# EAGLE design crypto_programmer (EAGLE 8.3.0)

## Sheet 1 of 2
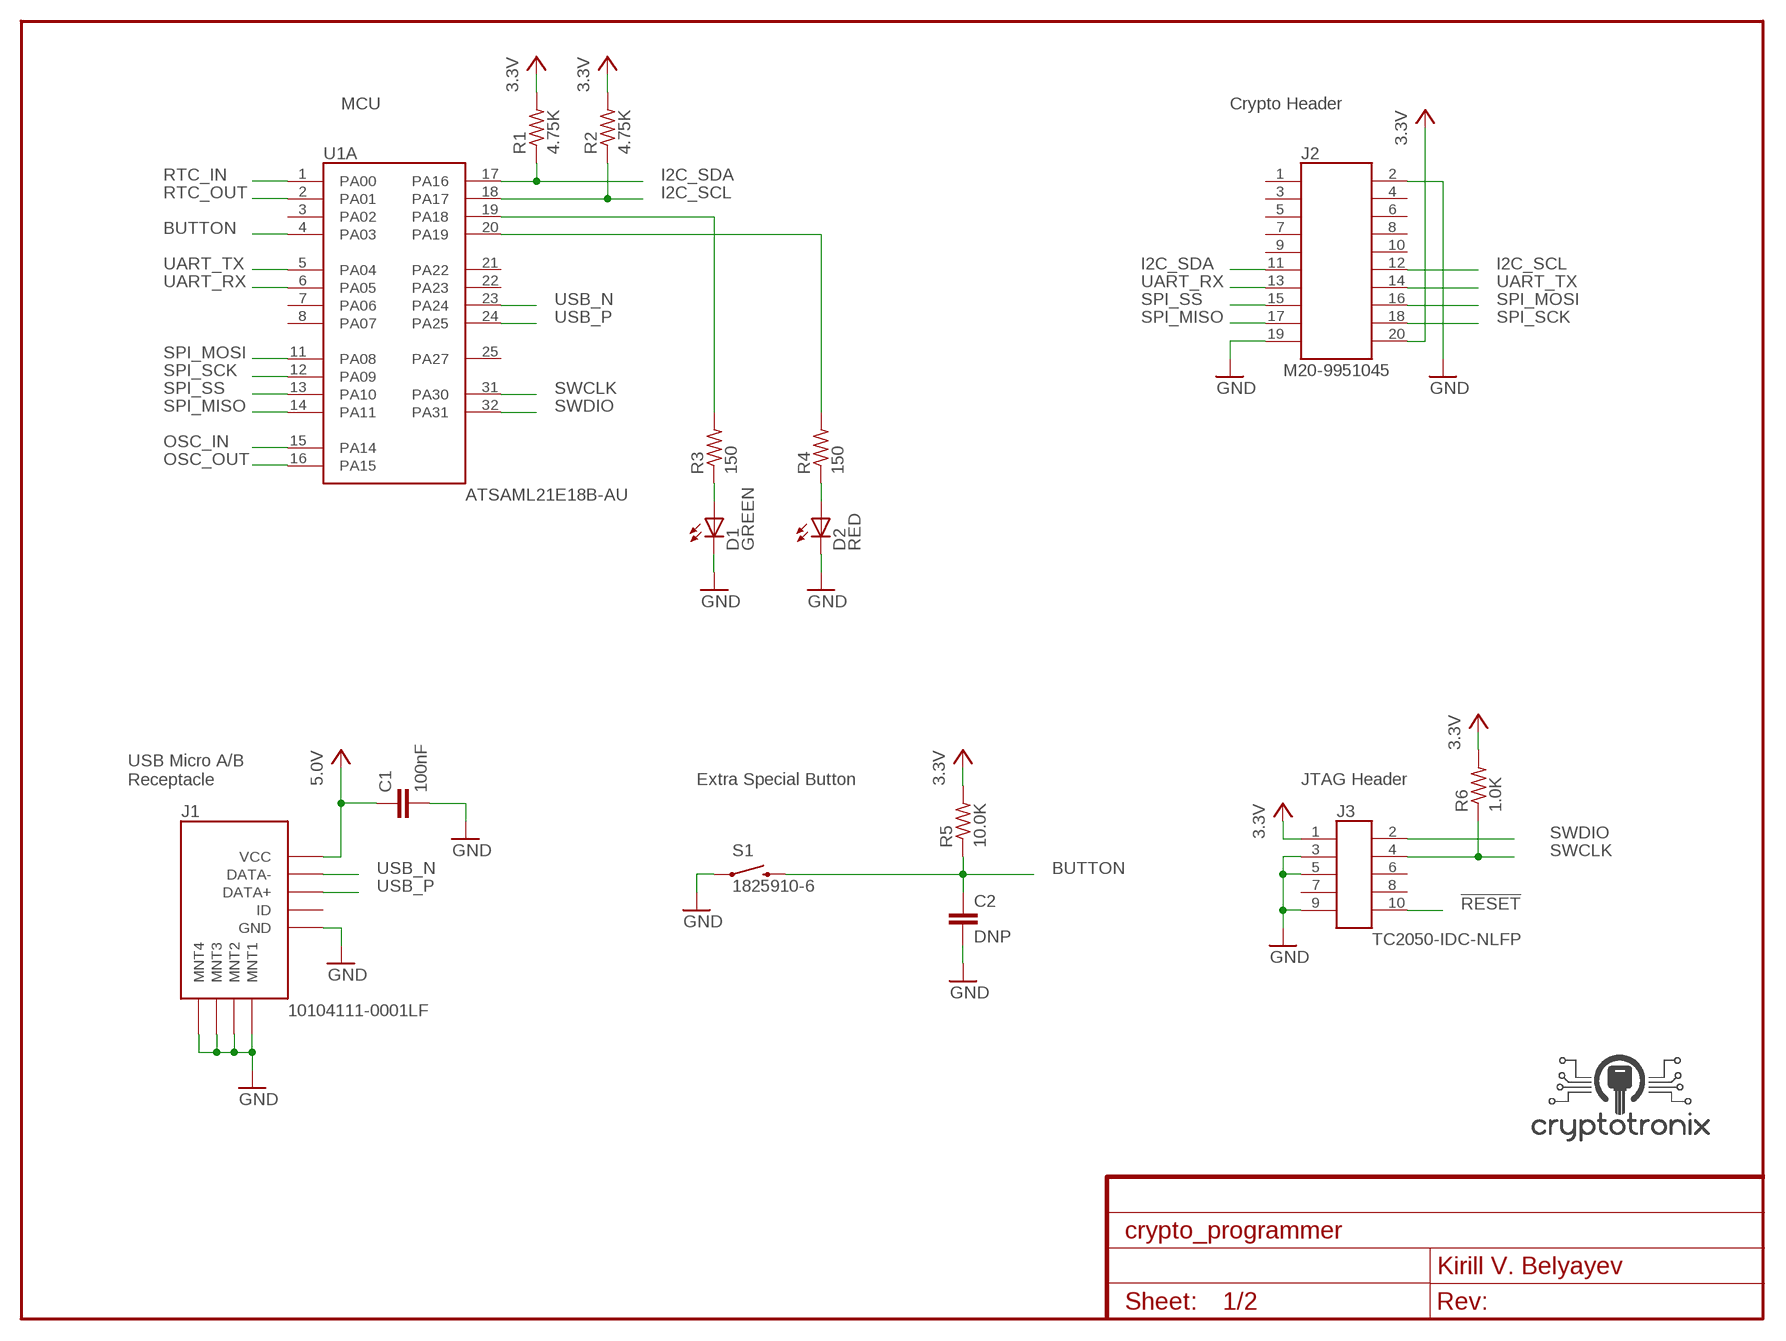
[diagram p0: schematic, sheet 1]
FRAME1 (FRAME-LETTER): CNAME: MCU Connections; CREVISION: A; DESIGNER: Kirill V. Belyayev

### Parts
C1  100nF  C-EUC0603  [C0603]
C2  DNP  C-EUC0603  [C0603]
D1  GREEN  LTST-C190GKT  [0603]
D2  RED  LTST-C190EKT  [0603]
J1  10104111-0001LF  [10104111-0001LF]
J2  M20-9951045  [M20-9951045]
J3  TC2050-IDC-NLFP  [TC2050-IDC-NLFP]
LOGO1  CRYPTOTRONIX_LOGO  [CRYPTOTRONIX_LOGO]
R1  4.75K  R-US_R0603  [R0603]
R2  4.75K  R-US_R0603  [R0603]
R3  150  R-US_R0603  [R0603]
R4  150  R-US_R0603  [R0603]
R5  10.0K  R-US_R0603  [R0603]
R6  1.0K  R-US_R0603  [R0603]
S1  1825910-6  SWITCH-TACT-TH  [SWITCH-TACT-TH]
U1  ATSAML21E18B-AU  [ATSAML21E18-AU]

### Nets
0V: C1.2 C2.2 D1.C D2.C J1.P$5(GND) J1.P$6(MNT1) J1.P$7(MNT2) J1.P$8(MNT3) J1.P$9(MNT4) J2.2 J2.19 J3.3 J3.5 J3.9 S1.1 ; supply symbol labelled GND ; also sheet 2
3.3V: J2.20 J3.1 R1.2 R2.2 R5.2 R6.2 ; also sheet 2
5.0V: C1.1 J1.P$1(VCC) ; also sheet 2
!RESET: J3.10 ; also sheet 2
BUTTON: C2.1 R5.1 S1.3 U1.4(A:PA03)
I2C_SCL: J2.12 R2.1 U1.18(A:PA17) ; also sheet 2
I2C_SDA: J2.11 R1.1 U1.17(A:PA16) ; also sheet 2
N$1: R4.2 U1.20(A:PA19)
N$2: D2.A R4.1
N$11: D1.A R3.1
N$13: R3.2 U1.19(A:PA18)
OSC_IN: U1.15(A:PA14) ; also sheet 2
OSC_OUT: U1.16(A:PA15) ; also sheet 2
RTC_IN: U1.1(A:PA00) ; also sheet 2
RTC_OUT: U1.2(A:PA01) ; also sheet 2
SPI_MISO: J2.17 U1.14(A:PA11)
SPI_MOSI: J2.16 U1.11(A:PA08)
SPI_SCK: J2.18 U1.12(A:PA09)
SPI_SS: J2.15 U1.13(A:PA10)
SWCLK: J3.4 R6.1 U1.31(A:PA30)
SWDIO: J3.2 U1.32(A:PA31)
UART_RX: J2.13 U1.6(A:PA05) ; also sheet 2
UART_TX: J2.14 U1.5(A:PA04) ; also sheet 2
USB_N: J1.P$2(DATA-) U1.23(A:PA24)
USB_P: J1.P$3(DATA+) U1.24(A:PA25)
Unconnected: J1.P$4(ID) J2.1 J2.3 J2.4 J2.5 J2.6 J2.7 J2.8 J2.9 J2.10 J3.6 J3.7 J3.8 U1.3(A:PA02) U1.7(A:PA06) U1.8(A:PA07) U1.21(A:PA22) U1.22(A:PA23) U1.25(A:PA27)

### Notes on the sheet
- MCU | Crypto Header
- USB Micro A/B
  Receptacle
- Extra Special Button | JTAG Header

## Sheet 2 of 2
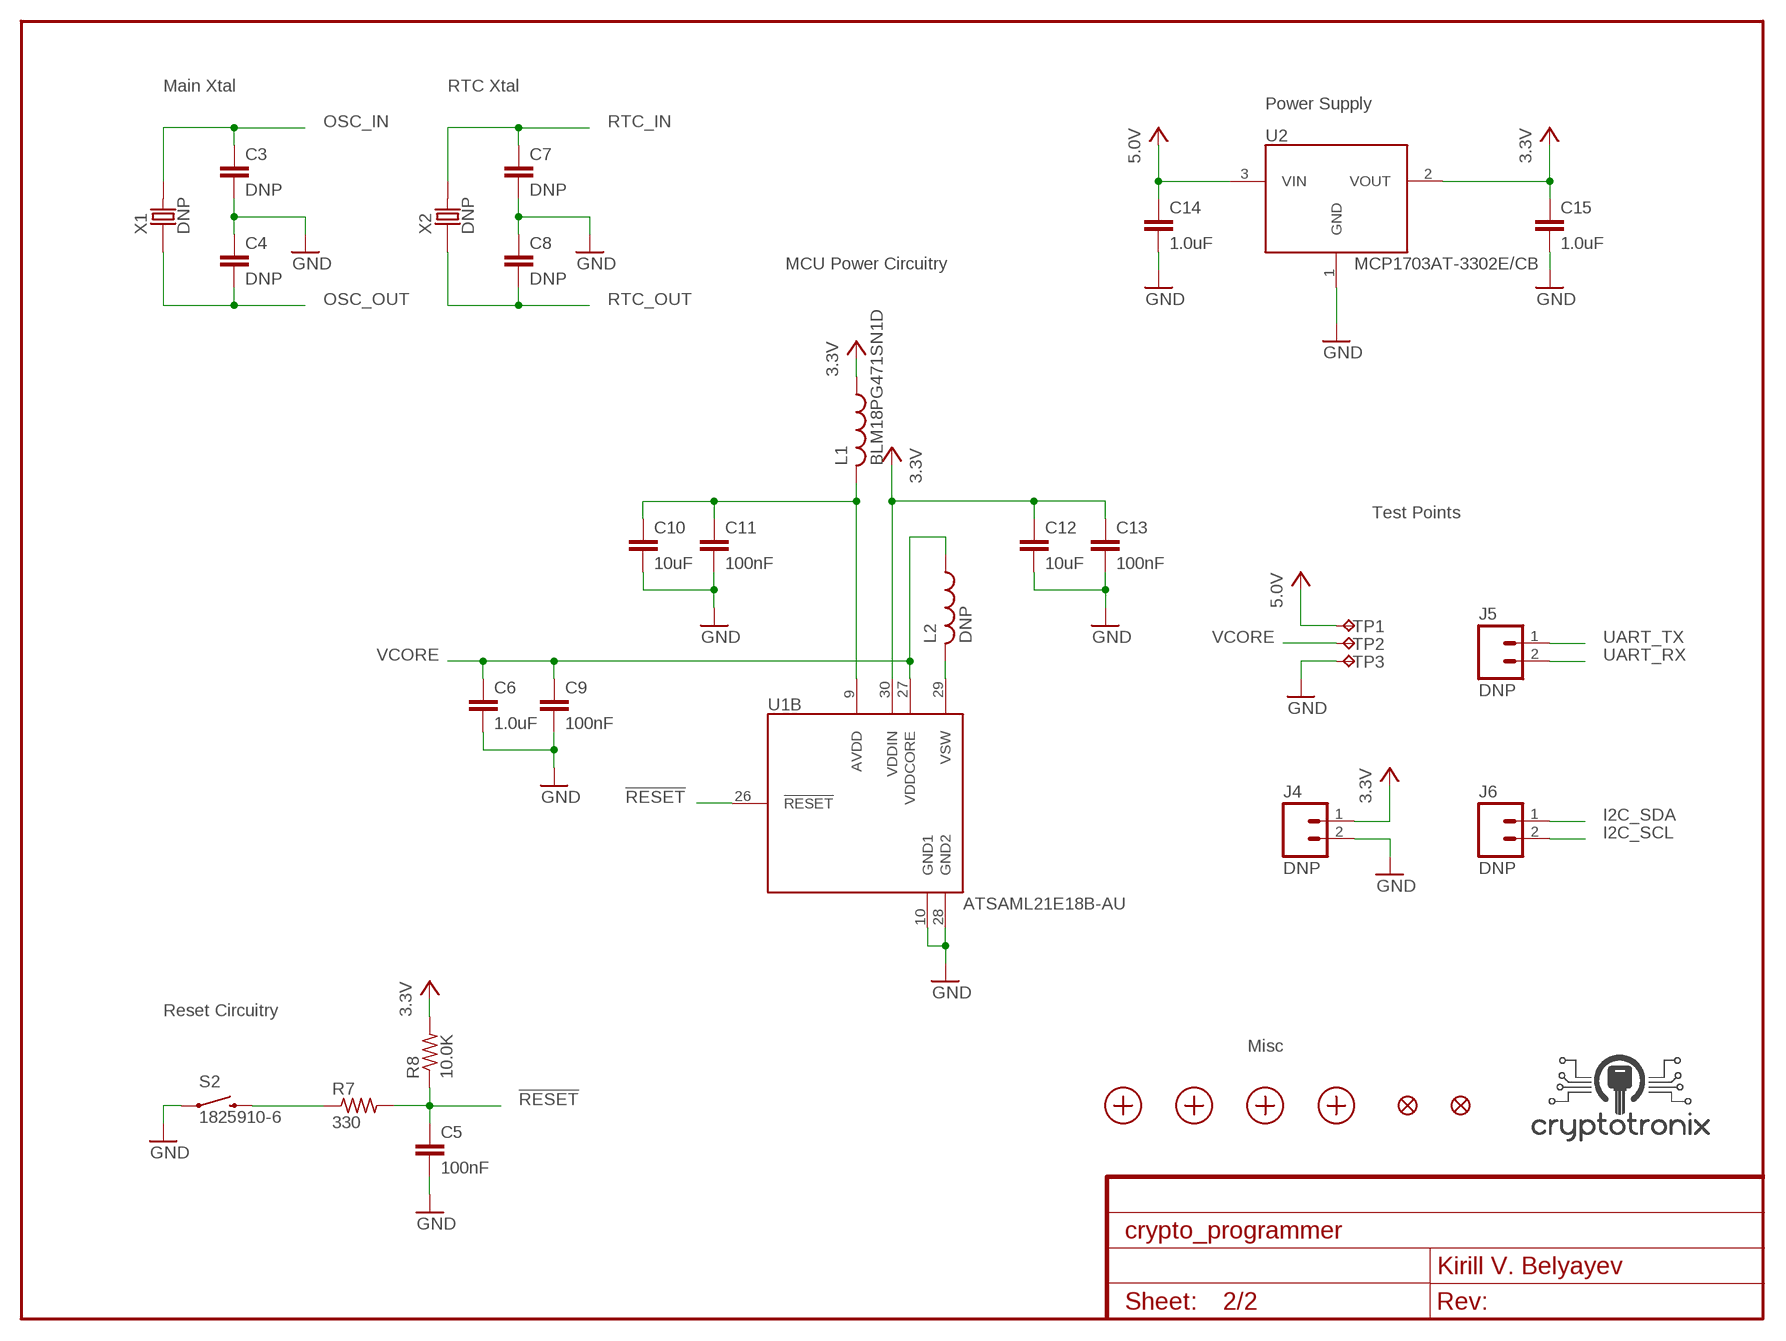
[diagram p1: schematic, sheet 2]
FRAME2 (FRAME-LETTER): CNAME: Power; CREVISION: A; DESIGNER: Kirill V. Belyayev

### Parts
C3  DNP  C-EUC0603  [C0603]
C4  DNP  C-EUC0603  [C0603]
C5  100nF  C-EUC0603  [C0603]
C6  1.0uF  C-EUC0603  [C0603]
C7  DNP  C-EUC0603  [C0603]
C8  DNP  C-EUC0603  [C0603]
C9  100nF  C-EUC0603  [C0603]
C10  10uF  C-EUC0805  [C0805]
C11  100nF  C-EUC0603  [C0603]
C12  10uF  C-EUC0805  [C0805]
C13  100nF  C-EUC0603  [C0603]
C14  1.0uF  C-EUC0603  [C0603]
C15  1.0uF  C-EUC0603  [C0603]
FD1  FIDUCIALUFIDUCIAL  [MICRO-FIDUCIAL]
FD2  FIDUCIALUFIDUCIAL  [MICRO-FIDUCIAL]
J4  DNP  M20-9990246  [M20-9990246]
J5  DNP  M20-9990246  [M20-9990246]
J6  DNP  M20-9990246  [M20-9990246]
L1  BLM18PG471SN1D  L0603  [L0603]
L2  DNP  L0603  [L0603]
LOGO2  CRYPTOTRONIX_LOGO  [CRYPTOTRONIX_LOGO]
MNT1  MOUNT-HOLE-NO-PLATE4-40  [MOUNT-HOLE-NO-PLATE-4-40]
MNT2  MOUNT-HOLE-NO-PLATE4-40  [MOUNT-HOLE-NO-PLATE-4-40]
MNT3  MOUNT-HOLE-NO-PLATE4-40  [MOUNT-HOLE-NO-PLATE-4-40]
MNT4  MOUNT-HOLE-NO-PLATE4-40  [MOUNT-HOLE-NO-PLATE-4-40]
R7  330  R-US_R0603  [R0603]
R8  10.0K  R-US_R0603  [R0603]
S2  1825910-6  SWITCH-TACT-TH  [SWITCH-TACT-TH]
TP1  TEST-POINT40MIL  [TEST-POINT-40MILL]
TP2  TEST-POINT40MIL  [TEST-POINT-40MILL]
TP3  TEST-POINT40MIL  [TEST-POINT-40MILL]
U2  MCP1703AT-3302E/CB  [MCP1703AT-3302E/CB]
X1  DNP  ABL-8.000MHZ-B2  [ABL-8.000MHZ-B2]
X2  DNP  ABS07AIG-32.768KHZ-9-T  [ABS07AIG-32.768KHZ-9-T]

### Nets
0V: C3.2 C4.1 C5.2 C6.2 C7.2 C8.1 C9.2 C10.2 C11.2 C12.2 C13.2 C14.2 C15.2 J4.2 S2.1 TP3.1(PP) U1.10(B:GND1) U1.28(B:GND2) U2.1(GND) ; supply symbol labelled GND ; also sheet 1
3.3V: C12.1 C13.1 C15.1 J4.1 L1.1 R8.2 U1.30(B:VDDIN) U2.2(VOUT) ; also sheet 1
5.0V: C14.1 TP1.1(PP) U2.3(VIN) ; also sheet 1
!RESET: C5.1 R7.2 R8.1 U1.26(B:!RESET) ; also sheet 1
I2C_SCL: J6.2 ; also sheet 1
I2C_SDA: J6.1 ; also sheet 1
N$3: L2.2 U1.29(B:VSW)
N$4: C10.1 C11.1 L1.2 U1.9(B:AVDD)
N$9: R7.1 S2.3
OSC_IN: C3.1 X1.2 ; also sheet 1
OSC_OUT: C4.2 X1.1 ; also sheet 1
RTC_IN: C7.1 X2.2 ; also sheet 1
RTC_OUT: C8.2 X2.1 ; also sheet 1
UART_RX: J5.2 ; also sheet 1
UART_TX: J5.1 ; also sheet 1
VCORE: C6.1 C9.1 L2.1 TP2.1(PP) U1.27(B:VDDCORE)

### Notes on the sheet
- Main Xtal | RTC Xtal
- Power Supply
- MCU Power Circuitry
- Test Points
- Reset Circuitry
- Misc

## Library data of the parts
C1-C15 = rcl:C-EU: CAPACITOR, European symbol
D1 D2 = KVB-diodes:LTST-C190: LED Indication Discrete 2.0V 10mA Test Current 0603 (1608 Metric); MAN-PART_NUM: LTST-C190; MANUFACTURER: Lite-On Inc.
FD1 FD2 = KVB-misc:FIDUCIAL: Fiducial Alignment Points Various fiducial points for machine vision alignment.
J1 = KVB-connectors:10104111-0001LF: USB - micro AB USB 2.0 Receptacle Connector 5 Position Surface Mount Right Angle; MAN-PART_NUM: 10104111-0001LF; MANUFACTURER: Amphenol
J2 = KVB-connectors:M20-9951045: 20 Positions Header Cuttable Connector 0.100" (2.54mm) Through Hole, Right Angle Gold
J3 = KVB-connectors:TC2050-IDC-NLFP: JTAG Cable PLUG-OF-NAILS 10-PIN W/LEGS; MAN-PART_NUM: TC2050-IDC-NLFP; MANUFACTURER: Tag Connect
J4-J6 = KVB-connectors:M20-9990246: 2 Positions Header Unshrouded Breakaway Connector 0.100" (2.54mm) Through Hole Tin; MAN-PART_NUM: M20-9990246; MANUFACTURER: Harwin Inc.
L1 L2 = KVB-inductors:L: Various Inductors
LOGO1 LOGO2 = KVB-misc:CRYPTOTRONIX_LOGO: Cryptotronix Logo
MNT1-MNT4 = KVB-misc:MOUNT-HOLE-NO-PLATE: Various non plated mountain holes
R1-R8 = rcl:R-US_: RESISTOR, American symbol
S1 S2 = KVB-switches:SWITCH-TACT: Standard Tactile Switch SPST-NO Top Actuated; MAN-PART_NUM: 1825910-6; MANUFACTURER: TE Connectivity
TP1-TP3 = KVB-misc:TEST-POINT: Various Test Points
U1 = KVB-MCUs:ATSAML21E18B-AU: ARM® Cortex®-M0+ SAM L21E Microcontroller IC 32-Bit 48MHz 256KB (256K x 8) FLASH 32-TQFP (7x7); MAN-PART_NUM: ATSAML21E18B-AUT; MANUFACTURER: Atmel
U2 = KVB-ICs:MCP1703AT-3302E/CB: Linear Voltage Regulator IC Positive Fixed Output 3.3V 250mA SOT-23A-3; MAN-PART_NUM: MCP1703AT-3302E/CB; MANUFACTURER: Microchip Technology
X1 = KVB-crystals:ABL-8.000MHZ-B2: 8MHz ±20ppm Crystal 18pF 80 Ohm -20°C ~ 70°C Through Hole HC49/US; MAN-PART_NUM: ABL-8.000MHZ-B2; MANUFACTURER: Abracon
X2 = KVB-crystals:ABS07AIG-32.768KHZ-9-T: 32.768kHz ±20ppm Crystal 9pF 70 kOhm -40°C ~ 125°C AEC-Q200 Surface Mount 2-SMD, No Lead; MAN-PART_NUM: ABS07AIG-32.768KHZ-9-T; MANUFACTURER: Abracon

## Board
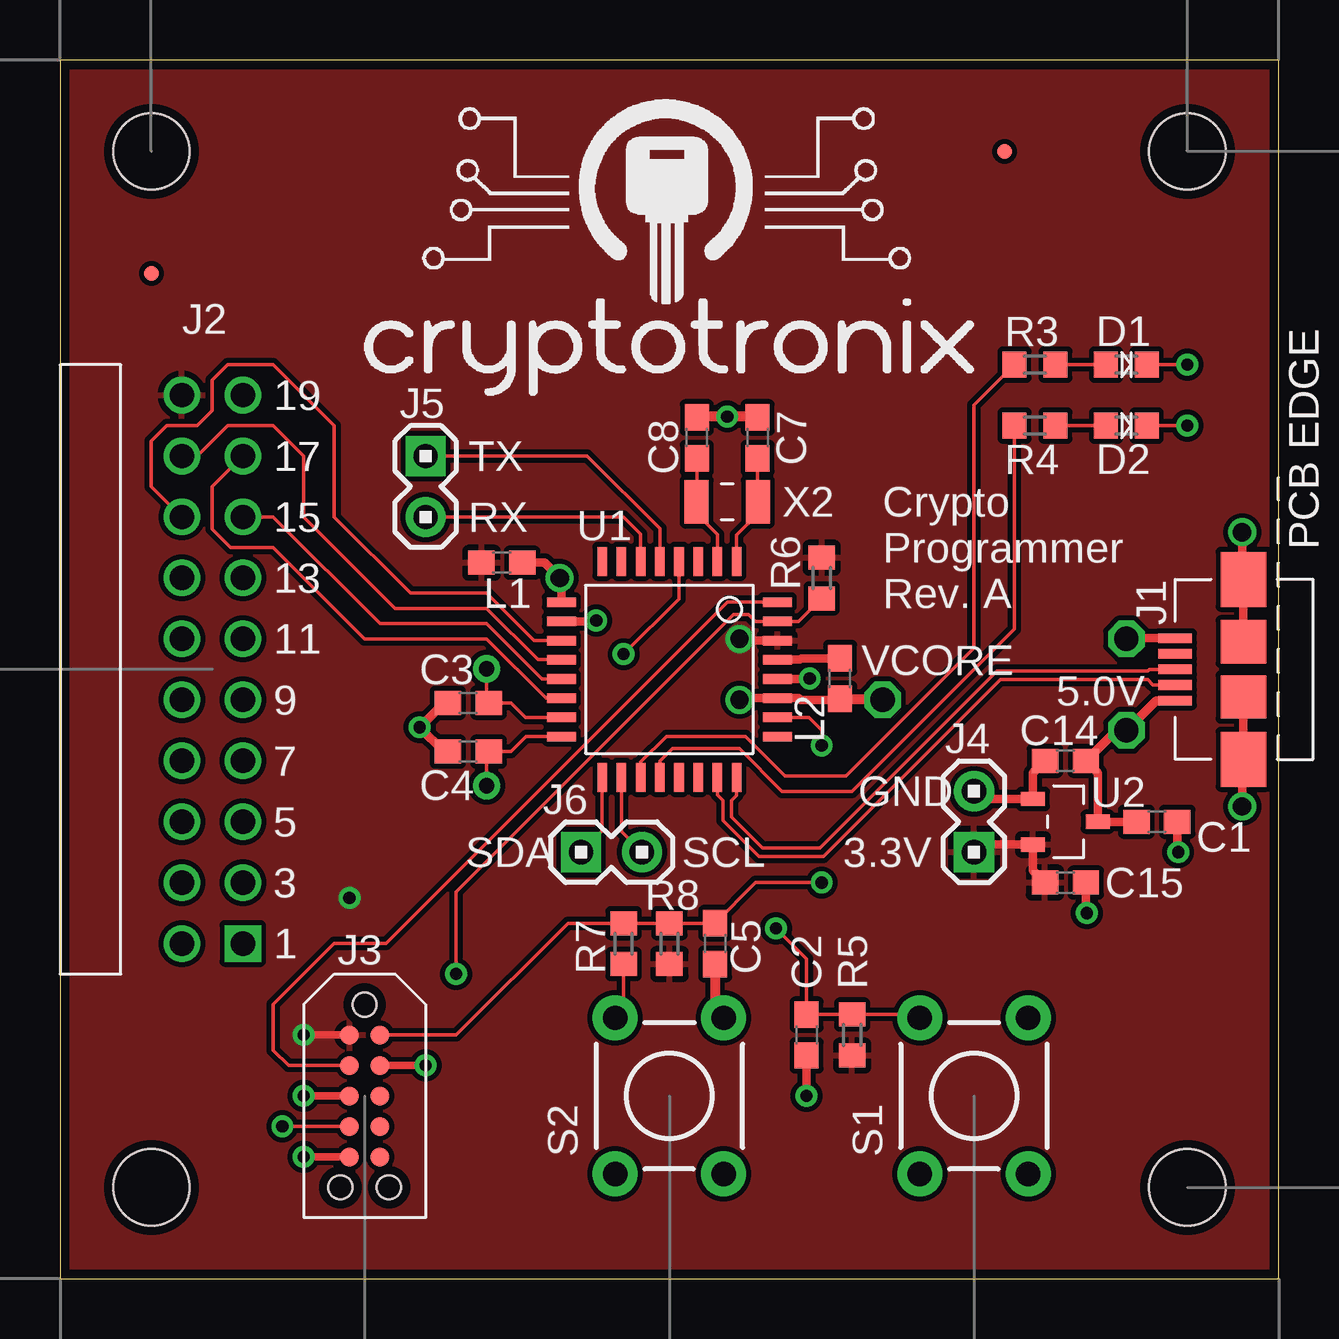
[diagram p2: board, top side]
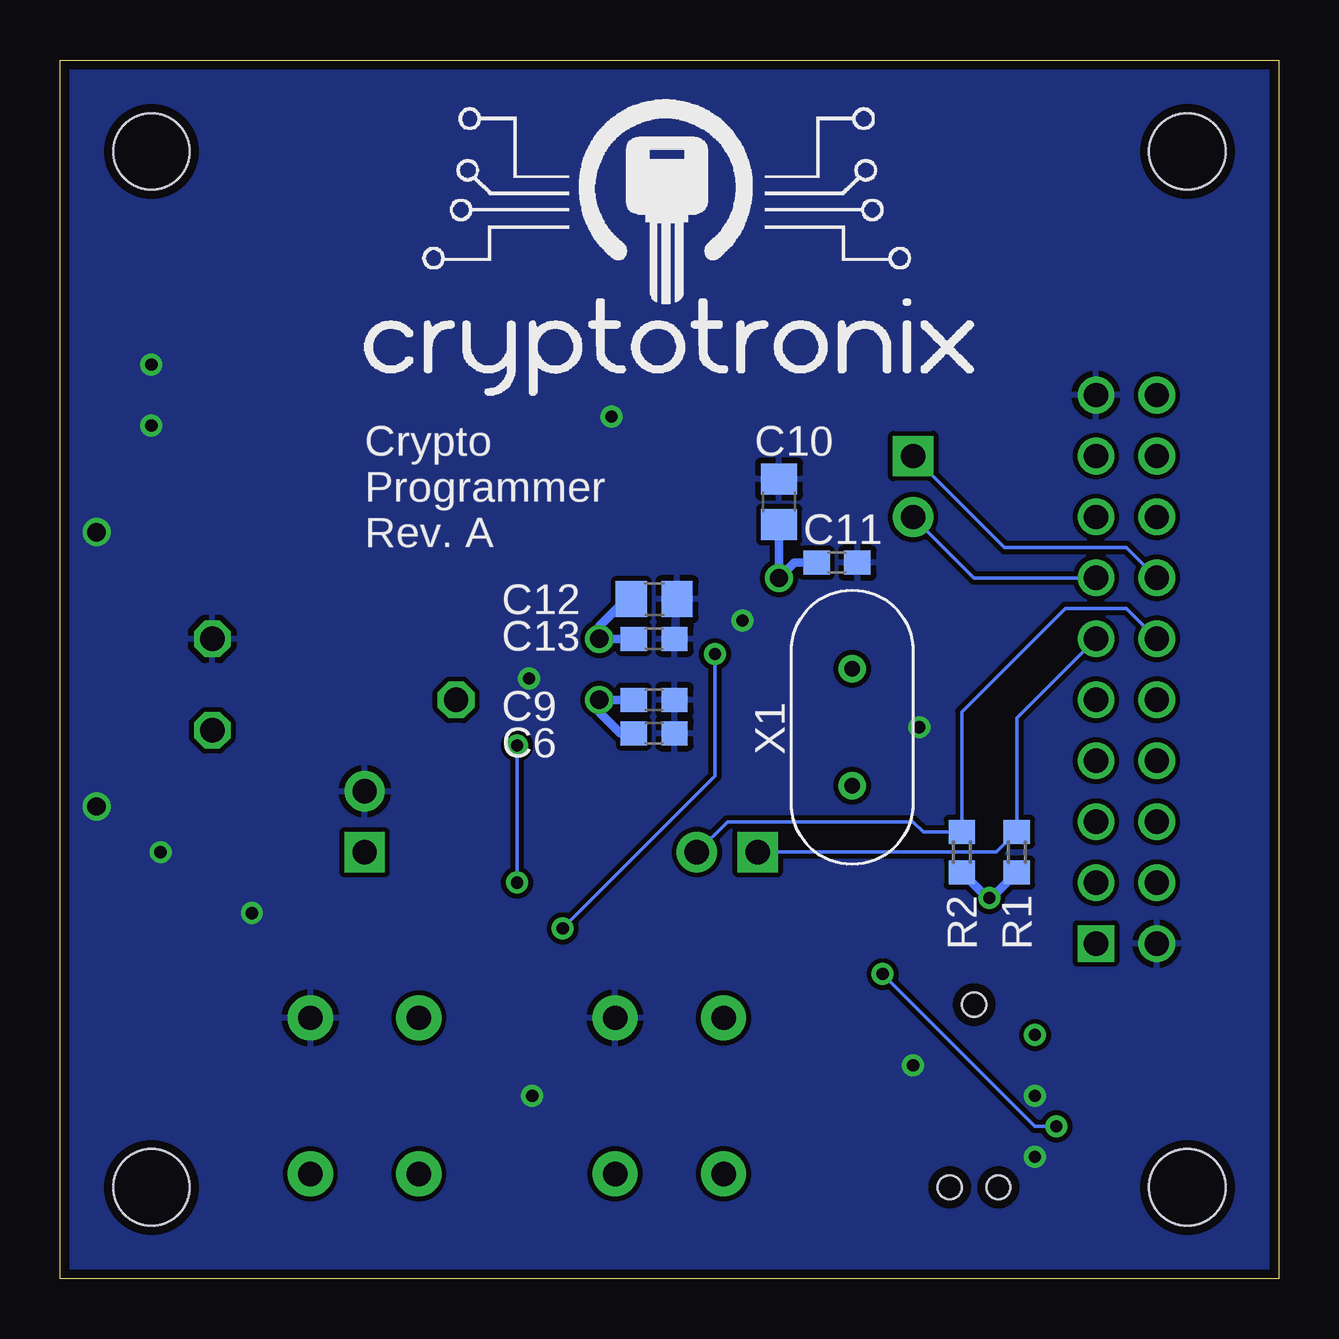
[diagram p3: board, bottom side, seen from below]

Size 50.8 x 50.8 mm. Coordinates in mm from the lower left corner, seen from the top.
Outline: 0,0 50.8,0 50.8,50.8 0,50.8 0,0
Copper layers (1*16): Top 0.035mm / dielectric 1.5mm / Bottom 0.035mm
Design rules "KVB-2layer": minimum track width 6mil, minimum drill 15mil, track to track 8mil, track to pad 8mil, pad to pad 8mil, via to via 8mil, smd to smd 8mil, copper to edge 15mil, drill to drill 8mil, minimum pad ring 10mil, minimum via ring 8mil, stop-mask expansion 3mil, vias tented up to drill 0mil, thermal gap 10mil

### Footprints (pad centres in the part's own frame; a part is rotated, then mirrored left to right if it is on the bottom)
C0603 = smd 1.1 x 1: 1 -0.85,0; 2 0.85,0
C0805 = smd 1.3 x 1.5: 1 -0.95,0; 2 0.95,0
0603 = smd 1.1 x 1: A 0,-0.85; C 0,0.85
MICRO-FIDUCIAL = smd 0.635 x 0.635: 1 0,0
10104111-0001LF = smd 0.4 x 1.4: P$1 -1.3,0; P$2 -0.65,0; P$3 0,0; P$4 0.65,0; P$5 1.3,0 | smd 2.3 x 1.9: P$6 -3.75,-2.85; P$7 3.75,-2.85 | smd 1.8 x 1.9: P$8 -1.15,-2.85; P$9 1.15,-2.85
M20-9951045 = drill 1.016 square: 1 -1.27,0 | drill 1.016: 2 1.27,0; 3 -1.27,-2.54; 4 1.27,-2.54; 5 -1.27,-5.08; 6 1.27,-5.08; 7 -1.27,-7.62; 8 1.27,-7.62; 9 -1.27,-10.16; 10 1.27,-10.16; 11 -1.27,-12.7; 12 1.27,-12.7; 13 -1.27,-15.24; 14 1.27,-15.24; 15 -1.27,-17.78; 16 1.27,-17.78; 17 -1.27,-20.32; 18 1.27,-20.32; 19 -1.27,-22.86; 20 1.27,-22.86
TC2050-IDC-NLFP = smd 0.787 x 0.787: 1 -2.54,-0.635; 2 -1.27,-0.635; 3 0,-0.635; 4 1.27,-0.635; 5 2.54,-0.635; 6 2.54,0.635; 7 1.27,0.635; 8 0,0.635; 9 -1.27,0.635; 10 -2.54,0.635 | hole 1: -3.81,0; 3.81,-1.016; 3.81,1.016
M20-9990246 = drill 1.016 pad 1.676 square: 1 -1.27,0 | drill 1.016 pad 1.676: 2 1.27,0
L0603 = smd 1.1 x 1: 1 -0.85,0; 2 0.85,0
MOUNT-HOLE-NO-PLATE-4-40 = hole 3.175: 0,0
R0603 = smd 1 x 1.1: 1 -0.85,0; 2 0.85,0
SWITCH-TACT-TH = drill 1.016 pad 1.88: 1 -3.251,2.261; 2 3.251,2.261; 3 -3.251,-2.261; 4 3.251,-2.261
TEST-POINT-40MILL = drill 1.016 pad 1.524 octagon: 1 0,0
ATSAML21E18-AU = smd 1.2 x 0.4: 1 -4.5,2.8; 2 -4.5,2; 3 -4.5,1.2; 4 -4.5,0.4; 5 -4.5,-0.4; 6 -4.5,-1.2; 7 -4.5,-2; 8 -4.5,-2.8; 17 4.5,-2.8; 18 4.5,-2; 19 4.5,-1.2; 20 4.5,-0.4; 21 4.5,0.4; 22 4.5,1.2; 23 4.5,2; 24 4.5,2.8 | smd 0.4 x 1.2: 9 -2.8,-4.5; 10 -2,-4.5; 11 -1.2,-4.5; 12 -0.4,-4.5; 13 0.4,-4.5; 14 1.2,-4.5; 15 2,-4.5; 16 2.8,-4.5; 25 2.8,4.5; 26 2,4.5; 27 1.2,4.5; 28 0.4,4.5; 29 -0.4,4.5; 30 -1.2,4.5; 31 -2,4.5; 32 -2.8,4.5
MCP1703AT-3302E/CB = smd 0.6 x 1: 1 -0.95,-1.35; 2 0.95,-1.35; 3 0,1.35
ABL-8.000MHZ-B2 = drill 0.635: 1 -2.438,0; 2 2.438,0
ABS07AIG-32.768KHZ-9-T = smd 1 x 1.8: 1 -1.275,0; 2 1.275,0

### Placement (x,y rotation side)
C1  45.72,19.05 0 top
C2  31.11,10.16 270 top
C3  17.02,24 180 top
C4  17.02,21.97 0 top
C5  27.3,13.97 270 top
C6  26.04,22.73 0 bottom
C7  29.08,35.05 90 top
C8  26.54,35.05 270 top
C9  26.04,24.13 0 bottom
C10  20.83,32.38 90 bottom
C11  18.41,29.84 0 bottom
C12  26.04,28.32 0 bottom
C13  26.04,26.67 0 bottom
C14  41.91,21.59 180 top
C15  41.91,16.51 0 top
D1  44.45,38.1 270 top
D2  44.45,35.56 270 top
FD1  3.81,41.91 0 top
FD2  39.37,46.99 0 top
J1  46.48,25.4 90 top
J2  6.35,13.97 180 top
J3  12.7,7.62 270 top
J4  38.1,19.05 90 top
J5  15.24,33.02 270 top
J6  22.99,17.78 0 top
L1  18.41,29.84 0 top
L2  32.51,25.02 90 top
LOGO1  38.1,36.83 0 bottom
LOGO2  12.7,36.83 0 top
MNT1  3.81,3.81 0 top
MNT2  46.99,46.99 0 top
MNT3  46.99,3.81 0 top
MNT4  3.81,46.99 0 top
R1  10.92,17.78 270 bottom
R2  13.21,17.78 270 bottom
R3  40.64,38.1 180 top
R4  40.64,35.56 180 top
R5  33.02,10.16 270 top
R6  31.75,29.21 90 top
R7  23.5,13.97 90 top
R8  25.4,13.97 270 top
S1  38.1,7.62 270 top
S2  25.4,7.62 270 top
TP1  44.45,22.86 0 top
TP2  34.29,24.13 0 top
TP3  44.45,26.67 0 top
U1  25.4,25.4 270 top
U2  41.91,19.05 270 top
X1  17.78,22.99 90 bottom
X2  27.81,32.38 0 top

### Tracks (layer width: path | path; a pad name or v marks a point on that pad's centre or on a via)
0V  (via drill 0.51, 0.76)
  Top 0.152: D1.C v46.99,38.1 | D2.C v46.99,35.56
  Top 0.305: J3.9 v15.24,8.89 | J3.3 v10.16,7.62 | J3.5 v10.16,5.08
  Top 0.356: U1.28 31.23,25 v31.25,25.02 | U1.10 22.32,27.4 v22.35,27.43 | C4.1 16,21.97 v14.99,22.99 16,24 C3.2 | v49.28,31.11 49.28,29.21 J1.P$7 J1.P$9 | v49.28,19.68 49.28,21.59 J1.P$6 J1.P$8 | J4.2 38.42,20 U2.1 40.56,21.09 C14.2 | J1.P$5 44.48,26.7 TP3.1 | C15.2 42.76,15.28 v42.8,15.24 | C1.2 46.57,17.82 v46.61,17.78 | C2.2 v31.11,7.62
  Top 0.406: C5.2 27.3,11.23 S2.1 | C8.1 26.58,35.94 v27.81,35.94 29.04,35.94 C7.2
  pour Bottom: -2.54,-2.54 53.34,-2.54 53.34,53.34 -2.54,53.34
3.3V  (via drill 0.51, 0.76)
  Top 0.305: J3.1 v10.16,10.16
  Top 0.356: U1.30 28.39,26.6 v28.32,26.67 | J4.1 38.42,18.1 U2.2 40.56,17.01 C15.1
  Bottom 0.356: C13.1 v28.32,26.67 28.32,27.18 27.18,28.32 C12.1 | R1.2 11.98,15.88 v12.06,15.88 12.15,15.88 R2.2
  pour Top: -1.27,-1.27 52.07,-1.27 52.07,52.07 -1.27,52.07
5.0V
  Top 0.356: C1.1 U2.3 43.26,21.09 C14.1 44.03,22.86 TP1.1 45.69,24.1 J1.P$1
!RESET  (via drill 0.51)
  Top 0.152: J3.10 16.51,10.16 21.17,14.82 R7.2 R8.1 C5.1 29,16.51 v31.75,16.51 | U1.26 30.57,23.4 31.21,23.4 31.75,22.86 v31.75,22.23
  Bottom 0.152: v31.75,22.23 v31.75,16.51
BUTTON  (via drill 0.51)
  Top 0.152: U1.4 25.8,28.34 v23.5,26.04 | v29.84,14.61 31.11,13.34 C2.1 R5.1 35.7,11.01 S1.3
  Bottom 0.152: v23.5,26.04 23.5,20.95 v29.84,14.61
I2C_SCL
  Top 0.152: U1.18 23.4,18.64 J6.2
  Bottom 0.152: J2.12 6.35,27.94 8.89,27.94 13.21,23.62 R2.1 14.82,18.63 15.24,19.05 22.99,19.05 J6.2
I2C_SDA
  Top 0.152: U1.17 22.6,18.66 J6.1
  Bottom 0.152: J6.1 11.77,17.78 R1.1 10.92,23.37 J2.11
N$1
  Top 0.152: U1.20 25,21.57 25.53,22.1 27.94,22.1 28.2,22.1 28.32,22.1 30.1,20.32 33.02,20.32 39.79,27.09 R4.2
N$2
  Top 0.152: D2.A R4.1
N$3
  Top 0.356: U1.29 30.85,25.8 30.9,25.86 32.5,25.86 L2.2
N$4  (via drill 0.76)
  Top 0.356: U1.9 20.9,29.14 v20.83,29.21 20.19,29.84 L1.2
  Bottom 0.356: C10.1 v20.83,29.21 20.19,29.84 L1.2
N$9
  Top 0.152: R7.1 23.5,11.23 S2.3
N$11
  Top 0.152: D1.A R3.1
N$13
  Top 0.152: U1.19 24.2,21.53 25.27,22.61 28.57,22.61 30.23,20.95 32.77,20.95 38.1,26.29 38.1,36.41 R3.2
OSC_IN
  Top 0.152: 17.82,24 17.78,24.04 | X1.2 17.78,24.09 C3.1 18.8,24 19.4,23.4 U1.15
  Top 0.203: 17.78,24.04 C3.1
OSC_OUT
  Top 0.152: X1.1 17.78,21.88 C4.2 18.8,21.97 19.43,22.6 U1.16
RTC_IN
  Top 0.152: U1.1 28.2,30.99 29.09,31.88 X2.2 C7.1
RTC_OUT
  Top 0.152: U1.2 27.4,31.02 26.67,31.75 26.67,32.25 X2.1 C8.2
SPI_MISO
  Top 0.152: U1.14 20.25,24.2 17.78,26.67 12.7,26.67 8.89,30.48 7.11,30.48 6.35,31.24 6.35,33.02 J2.17
SPI_MOSI
  Top 0.152: U1.11 19.75,26.6 17.78,28.57 14.61,28.57 11.43,31.75 11.43,35.56 8.89,38.1 6.99,38.1 6.35,37.47 6.35,36.2 5.71,35.56 4.45,35.56 3.81,34.92 3.81,33.02 J2.16
SPI_SCK
  Top 0.152: U1.12 19.92,25.8 17.78,27.94 13.97,27.94 10.16,31.75 10.16,34.29 8.89,35.56 6.99,35.56 5.71,34.29 J2.18
SPI_SS
  Top 0.152: U1.13 20.09,25 17.78,27.3 13.34,27.3 8.89,31.75 J2.15
SWCLK  (via drill 0.51)
  Top 0.152: v9.27,6.35 J3.4 | R6.1 30.79,27.4 U1.31 28.99,27.4 28.7,27.69 28.07,27.69 16.51,16.13 v16.51,12.7
  Bottom 0.152: v16.51,12.7 10.16,6.35 v9.27,6.35
SWDIO
  Top 0.152: U1.32 27.82,28.2 13.59,13.97 11.43,13.97 8.89,11.43 8.89,9.53 9.53,8.89 J3.2
UART_RX
  Top 0.152: U1.6 24.2,31.05 23.5,31.75 J5.2
  Bottom 0.152: J2.13 12.7,29.21 J5.2
UART_TX
  Top 0.152: U1.5 25,31.26 21.97,34.29 J5.1
  Bottom 0.152: J2.14 6.35,30.48 11.43,30.48 J5.1
USB_N
  Top 0.152: U1.23 27.4,20.17 27.64,19.94 27.64,19.1 29.14,17.6 31.82,17.6 39.19,24.97 45.34,24.97 45.56,24.75 J1.P$2
USB_P
  Top 0.152: U1.24 28.2,20.15 27.99,19.94 27.99,19.25 29.28,17.96 31.68,17.96 39.04,25.32 45.34,25.32 45.41,25.4 J1.P$3
VCORE  (via drill 0.76)
  Top 0.356: v28.32,24.13 28.39,24.2 U1.27 30.79,24.2 30.86,24.13 32.47,24.13 L2.1
  Top 0.406: L2.1 34.25,24.17 TP2.1
  Bottom 0.356: C9.1 v28.32,24.13 28.32,23.62 27.43,22.73 C6.1

### Text on the board
tPlace: Crypto / Programmer / Rev. A
bPlace: Crypto / Programmer / Rev. A
tNames: TX | RX | VCORE | 5.0V | GND | SDA | SCL | 3.3V